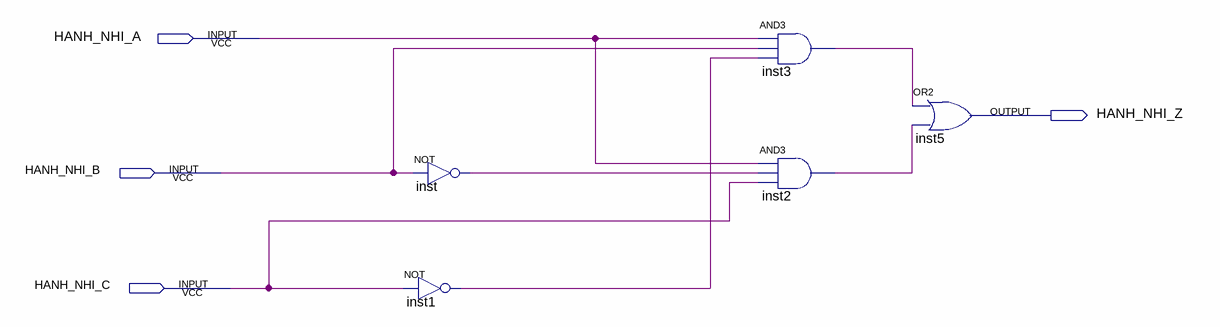
[diagram p0: schematic sheet]
// Quartus schematic Assignment4b.bdf as structural Verilog: 5 symbols, 4 pins
module Assignment4b (
  input  HANH_NHI_A,
  input  HANH_NHI_B,
  input  HANH_NHI_C,
  output HANH_NHI_Z
);

  wire inst1_out, inst2_out, inst3_out, inst_out;

  not inst (inst_out, HANH_NHI_B);
  not inst1 (inst1_out, HANH_NHI_C);
  and inst3 (inst3_out, HANH_NHI_A, HANH_NHI_B, inst1_out);
  and inst2 (inst2_out, HANH_NHI_A, inst_out, HANH_NHI_C);
  or inst5 (HANH_NHI_Z, inst3_out, inst2_out);
endmodule
